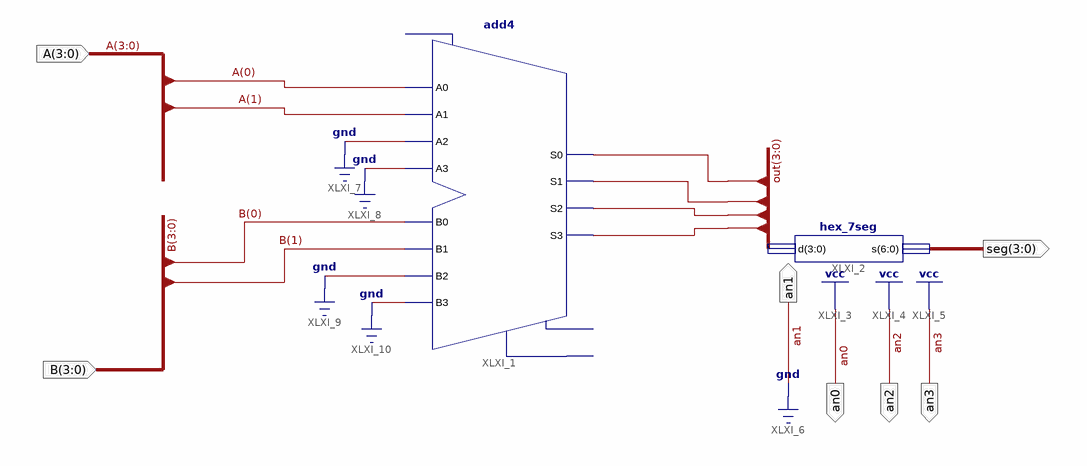
[diagram p0: schematic sheet 1]
// Xilinx ISE schematic osszeado_remake.sch (spartan3e) as structural Verilog: 2 symbols, 7 ports
module osszeado_remake (
  input  [3:0] B,
  input  [3:0] A,
  output [3:0] seg,
  output an0,
  output an2,
  output an3,
  output an1
);

  wire XLXN_15, XLXN_20, XLXN_21, XLXN_22;
  wire [3:0] out;

  add4 XLXI_1 (
    .A0(A[0]), .A1(A[1]), .A2(1'b0), .A3(1'b0), .B0(B[0]), .B1(B[1]), .B2(1'b0), .B3(1'b0), .S0(XLXN_15),
    .S1(XLXN_20), .S2(XLXN_21), .S3(XLXN_22));  // open: CI, CO, OFL
  hex_7seg XLXI_2 (.d(out), .s(seg));

  assign an0 = 1'b1;
  assign an1 = 1'b0;
  assign an2 = 1'b1;
  assign an3 = 1'b1;
endmodule
